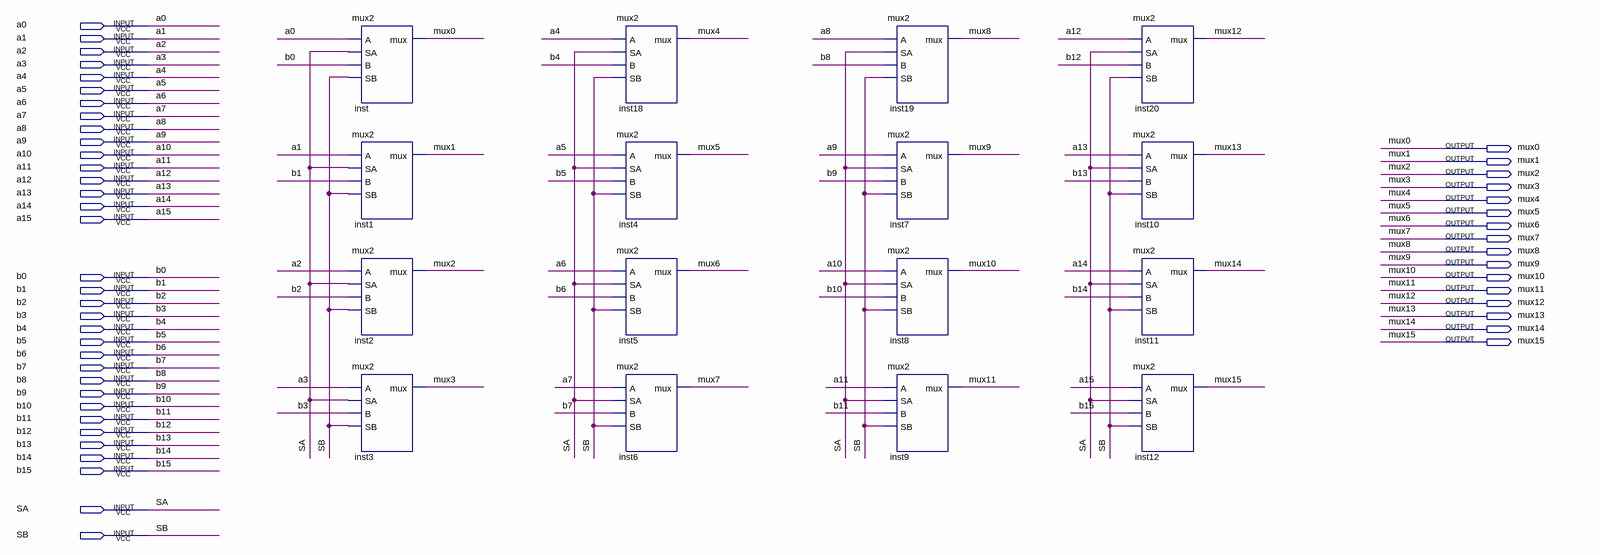
[diagram p0: schematic sheet]
// Quartus schematic mux16.bdf as structural Verilog: 16 symbols, 50 pins
module mux16 (
  input  a0,
  input  a1,
  input  a2,
  input  a3,
  input  a4,
  input  a5,
  input  a6,
  input  a7,
  input  a8,
  input  a9,
  input  a10,
  input  a11,
  input  a12,
  input  a13,
  input  a14,
  input  a15,
  input  b0,
  input  b1,
  input  b2,
  input  b3,
  input  b4,
  input  b5,
  input  b6,
  input  b7,
  input  b8,
  input  b9,
  input  b10,
  input  b11,
  input  b12,
  input  b13,
  input  b14,
  input  b15,
  input  SA,
  input  SB,
  output mux0,
  output mux1,
  output mux2,
  output mux3,
  output mux4,
  output mux5,
  output mux6,
  output mux7,
  output mux8,
  output mux9,
  output mux10,
  output mux11,
  output mux12,
  output mux13,
  output mux14,
  output mux15
);

  mux2 inst (.A(a0), .SA(SA), .B(b0), .SB(SB), .mux(mux0));
  mux2 inst1 (.A(a1), .SA(SA), .B(b1), .SB(SB), .mux(mux1));
  mux2 inst2 (.A(a2), .SA(SA), .B(b2), .SB(SB), .mux(mux2));
  mux2 inst3 (.A(a3), .SA(SA), .B(b3), .SB(SB), .mux(mux3));
  mux2 inst18 (.A(a4), .SA(SA), .B(b4), .SB(SB), .mux(mux4));
  mux2 inst4 (.A(a5), .SA(SA), .B(b5), .SB(SB), .mux(mux5));
  mux2 inst5 (.A(a6), .SA(SA), .B(b6), .SB(SB), .mux(mux6));
  mux2 inst6 (.A(a7), .SA(SA), .B(b7), .SB(SB), .mux(mux7));
  mux2 inst19 (.A(a8), .SA(SA), .B(b8), .SB(SB), .mux(mux8));
  mux2 inst7 (.A(a9), .SA(SA), .B(b9), .SB(SB), .mux(mux9));
  mux2 inst8 (.A(a10), .SA(SA), .B(b10), .SB(SB), .mux(mux10));
  mux2 inst9 (.A(a11), .SA(SA), .B(b11), .SB(SB), .mux(mux11));
  mux2 inst20 (.A(a12), .SA(SA), .B(b12), .SB(SB), .mux(mux12));
  mux2 inst10 (.A(a13), .SA(SA), .B(b13), .SB(SB), .mux(mux13));
  mux2 inst11 (.A(a14), .SA(SA), .B(b14), .SB(SB), .mux(mux14));
  mux2 inst12 (.A(a15), .SA(SA), .B(b15), .SB(SB), .mux(mux15));
endmodule
